# Altium schematic sheet pcb_3170100699.SchDoc
size A4
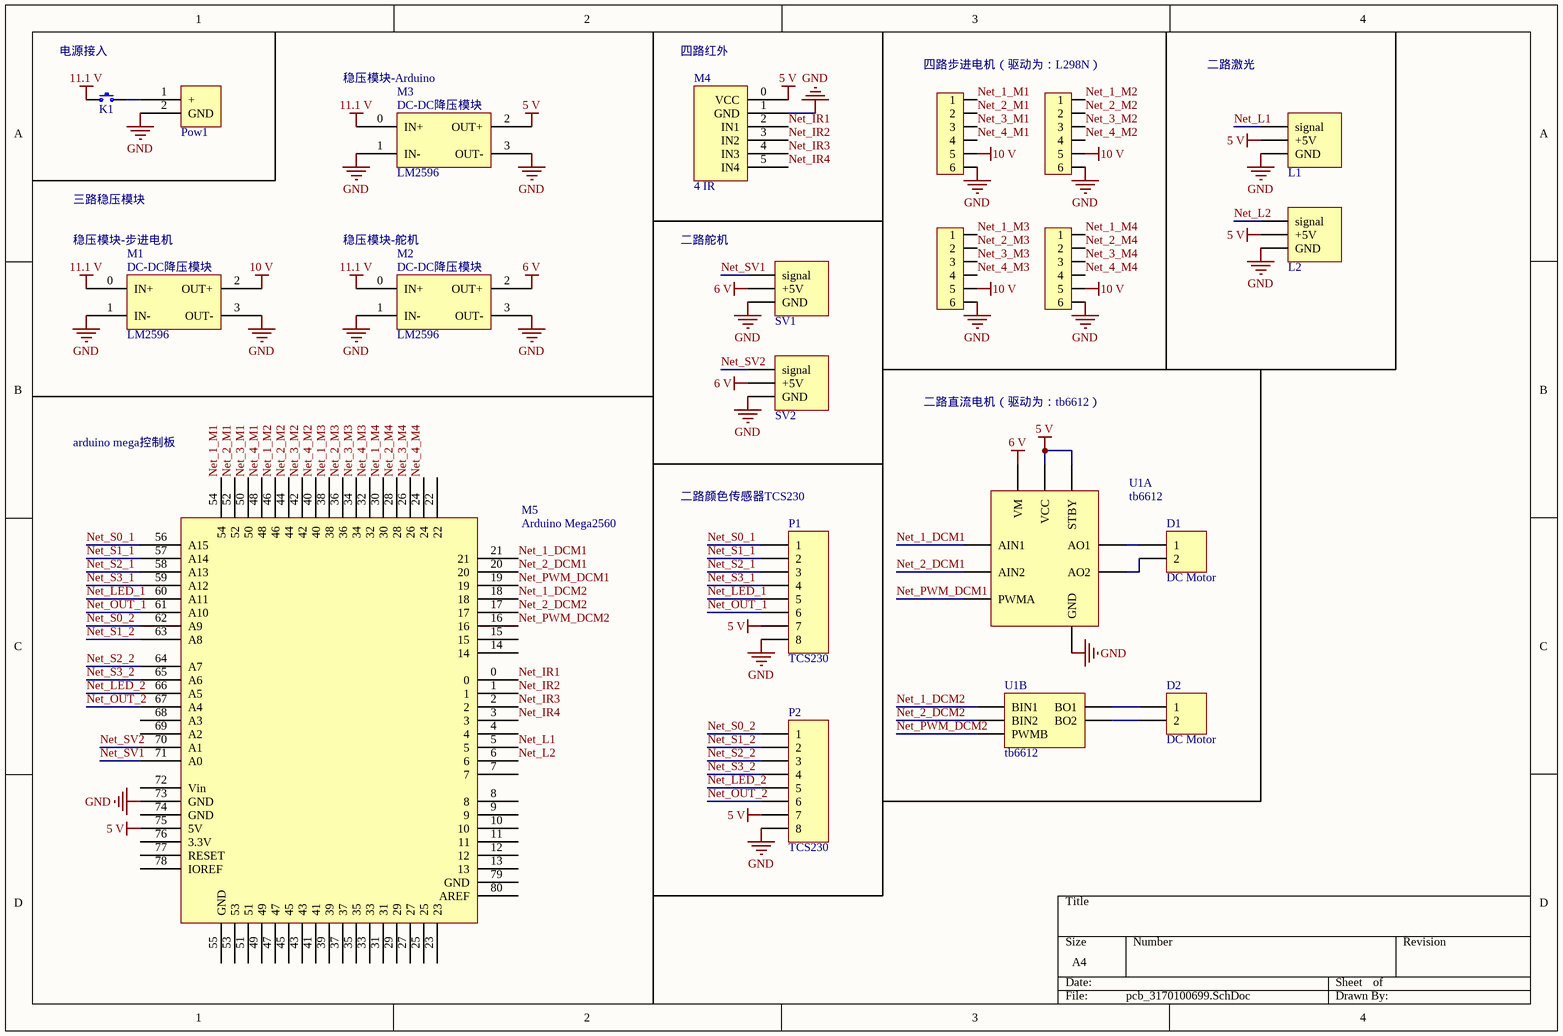
[diagram p0: pcb_3170100699.SchDoc]

## Parts
D1  DC Motor  [HDR1X2]
D2  DC Motor  [HDR1X2]
K1  key  [Header2]  (value not drawn)
L1  SERVO  [SIP3-1]  (value not drawn)
L2  SERVO  [SIP3-1]  (value not drawn)
M1  LM2596  [DC-DC降压]
M2  LM2596  [DC-DC降压]
M3  LM2596  [DC-DC降压]
M4  4 IR  [4 infrared avoidance - duplicate]
M5  Arduino Mega2560  [Arduino Mega2560]
P1  TCS230  [HDR1X8]
P2  TCS230  [HDR1X8]
Pow1  POWER  [Power]  (value not drawn)
SMotor1  SMotor  [SIP6-1]  (value not drawn)
SMotor2  SMotor  [SIP6-1]  (value not drawn)
SMotor3  SMotor  [SIP6-1]  (value not drawn)
SMotor4  SMotor  [SIP6-1]  (value not drawn)
SV1  SERVO  [SIP3-1]  (value not drawn)
SV2  SERVO  [SIP3-1]  (value not drawn)
U1  tb6612  [tb6612]  (parts A,B of 2)

## Nets
5 V: L1.2(+5V) L2.2(+5V) M3.2(OUT+) M4.0(VCC) M5.75(5V) P1.7 P2.7 U1.2(VCC) U1.13(STBY)
6 V: M2.2(OUT+) SV1.2(+5V) SV2.2(+5V) U1.1(VM)
10 V: M1.2(OUT+) SMotor1.5 SMotor2.5 SMotor3.5 SMotor4.5
11.1 V: K1.1 M1.0(IN+) M2.0(IN+) M3.0(IN+)
GND: L1.3(GND) L2.3(GND) M1.1(IN-) M1.3(OUT-) M2.1(IN-) M2.3(OUT-) M3.1(IN-) M3.3(OUT-) M4.1(GND) M5.73(GND) P1.8 P2.8 Pow1.2(GND) SMotor1.6 SMotor2.6 SMotor3.6 SMotor4.6 SV1.3(GND) SV2.3(GND) U1.8(GND)
Net_1_DCM1: M5.21 U1.14(AIN1)
Net_1_DCM2: M5.18 U1.12(BIN1)
Net_1_M1: M5.54 SMotor1.1
Net_1_M2: M5.46 SMotor2.1
Net_1_M3: M5.38 SMotor3.1
Net_1_M4: M5.30 SMotor4.1
Net_2_DCM1: M5.20 U1.15(AIN2)
Net_2_DCM2: M5.17 U1.11(BIN2)
Net_2_M1: M5.52 SMotor1.2
Net_2_M2: M5.44 SMotor2.2
Net_2_M3: M5.36 SMotor3.2
Net_2_M4: M5.28 SMotor4.2
Net_3_M1: M5.50 SMotor1.3
Net_3_M2: M5.42 SMotor2.3
Net_3_M3: M5.34 SMotor3.3
Net_3_M4: M5.26 SMotor4.3
Net_4_M1: M5.48 SMotor1.4
Net_4_M2: M5.40 SMotor2.4
Net_4_M3: M5.32 SMotor3.4
Net_4_M4: M5.24 SMotor4.4
Net_IR1: M4.2(IN1) M5.0
Net_IR2: M4.3(IN2) M5.1
Net_IR3: M4.4(IN3) M5.2
Net_IR4: M4.5(IN4) M5.3
Net_L1: L1.1(signal) M5.5
Net_L2: L2.1(signal) M5.6
Net_LED_1: M5.60(A11) P1.5
Net_LED_2: M5.66(A5) P2.5
Net_OUT_1: M5.61(A10) P1.6
Net_OUT_2: M5.67(A4) P2.6
Net_PWM_DCM1: M5.19 U1.16(PWMA)
Net_PWM_DCM2: M5.16 U1.10(PWMB)
Net_S0_1: M5.56(A15) P1.1
Net_S0_2: M5.62(A9) P2.1
Net_S1_1: M5.57(A14) P1.2
Net_S1_2: M5.63(A8) P2.2
Net_S2_1: M5.58(A13) P1.3
Net_S2_2: M5.64(A7) P2.3
Net_S3_1: M5.59(A12) P1.4
Net_S3_2: M5.65(A6) P2.4
Net_SV1: M5.71(A0) SV1.1(signal)
Net_SV2: M5.70(A1) SV2.1(signal)
NetD1_1: D1.1 U1.4(AO1)
NetD1_2: D1.2 U1.5(AO2)
NetD2_1: D2.1 U1.7(BO1)
NetD2_2: D2.2 U1.6(BO2)
NetK1_2: K1.2 Pow1.1(+)

Not connected (* = marked no-connect by the designer): M5 4 7 8 9 10 11 12 13 14 15 22 23 25 27 29 31 33 35 37 39 41 43 45 47 49 51 53 55(GND) 68(A3) 69(A2) 72(Vin) 74(GND) 76(3.3V) 77(RESET) 78(IOREF) 79(GND) 80(AREF)

## Notes on the sheet
- (near K1) 电源接入
- (near M3) 稳压模块-Arduino
- 四路红外
- (near SMotor1) 四路步进电机（驱动为：L298N）
- 二路激光
- (near M1) 稳压模块-步进电机
- 三路稳压模块
- (near M2) 稳压模块-舵机
- 二路舵机
- arduino mega控制板
- 二路直流电机（驱动为：tb6612）
- (near P1) 二路颜色传感器TCS230
- (in symbol LM2596) DC-DC降压模块

## Library data of the parts
D1 D2 = Header 2: Header, 2-Pin; LatestRevisionDate: 17-Jul-2002; LatestRevisionNote: Re-released for DXP Platform.; Publisher: Altium Limited
P1 P2 = Header 8: Header, 8-Pin; LatestRevisionDate: 17-Jul-2002; LatestRevisionNote: Re-released for DXP Platform.; Publisher: Altium Limited
SMotor1-SMotor4 = SIP6